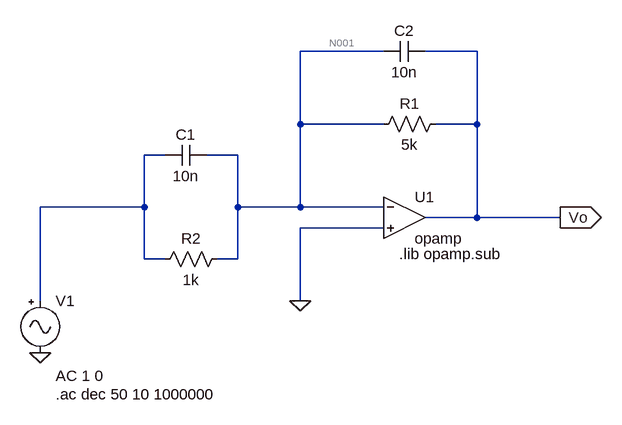
[diagram p0: schematic P4e.asc]
P4e.asc, the LTspice schematic file:
Version 4.1
SHEET 1 880 680
WIRE 464 -64 336 -64
WIRE 608 -64 528 -64
WIRE 336 48 336 -64
WIRE 464 48 336 48
WIRE 608 48 608 -64
WIRE 608 48 544 48
WIRE 128 96 96 96
WIRE 240 96 192 96
WIRE 96 176 96 96
WIRE 96 176 -64 176
WIRE 240 176 240 96
WIRE 336 176 336 48
WIRE 336 176 240 176
WIRE 464 176 336 176
WIRE 608 192 608 48
WIRE 608 192 528 192
WIRE 736 192 608 192
WIRE 464 208 336 208
WIRE 96 256 96 176
WIRE 128 256 96 256
WIRE 240 256 240 176
WIRE 240 256 208 256
WIRE -64 320 -64 176
WIRE 336 320 336 208
FLAG 336 320 0
FLAG -64 400 0
FLAG 736 192 Vo
IOPIN 736 192 Out
SYMBOL cap 192 80 R90
WINDOW 0 0 32 VBottom 2
WINDOW 3 32 32 VTop 2
SYMATTR InstName C1
SYMATTR Value 10n
SYMBOL OpAmps\\opamp 496 128 R0
SYMATTR InstName U1
SYMBOL cap 528 -80 R90
WINDOW 0 0 32 VBottom 2
WINDOW 3 32 32 VTop 2
SYMATTR InstName C2
SYMATTR Value 10n
SYMBOL res 560 32 R90
WINDOW 0 0 56 VBottom 2
WINDOW 3 32 56 VTop 2
SYMATTR InstName R1
SYMATTR Value 5k
SYMBOL res 224 240 R90
WINDOW 0 0 56 VBottom 2
WINDOW 3 32 56 VTop 2
SYMATTR InstName R2
SYMATTR Value 1k
SYMBOL Misc\\signal -64 304 R0
WINDOW 123 24 132 Left 2
WINDOW 39 0 0 Left 0
SYMATTR InstName V1
SYMATTR Value ""
SYMATTR Value2 AC 1 0
TEXT 488 248 Left 2 !.lib opamp.sub
TEXT -40 464 Left 2 !.ac dec 50 10 1000000

The netlist it stands for:
* P4e.asc
C1 N001 N002 10n
X§U1 N001 0 Vo opamp Aol=100K GBW=10Meg  ; pins invin noninvin out
C2 Vo N001 10n
R1 Vo N001 5k
R2 N001 N002 1k
V1 N002 0 AC 1 0
.lib opamp.sub
.ac dec 50 10 1000000
.backanno
.end

* Results of the author's LTspice run, read from the files saved beside the schematic
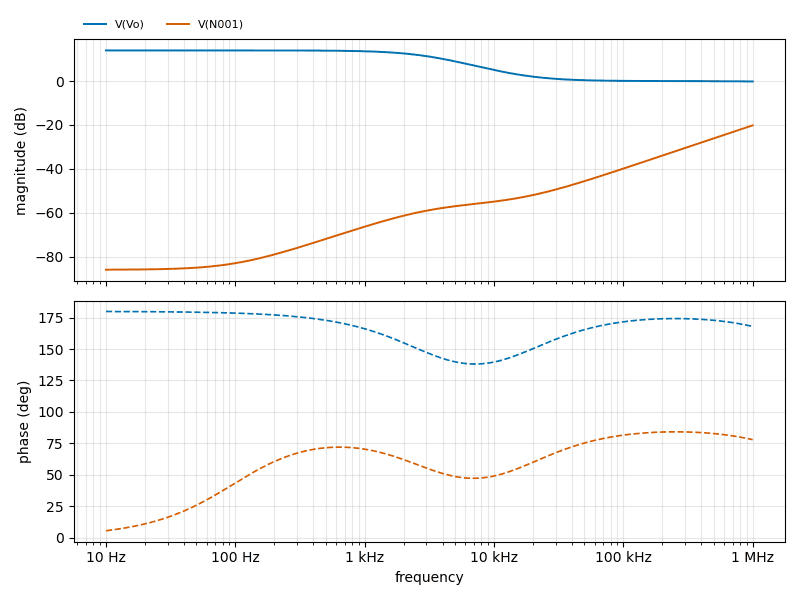
[diagram p1: AC Analysis of P4e.asc, plotted from the saved traces]
* AC Analysis, 1 run:
*   V(Vo): 13.98 dB at 10 Hz, -0.18 dB at 1 MHz, peak 13.98 dB at 10 Hz, 3 dB below the peak at 3.314 kHz
*   V(N001): -85.98 dB at 10 Hz, -20.18 dB at 1 MHz, peak -20.18 dB at 1 MHz, 3 dB below the peak at 700.1 kHz